# EAGLE design usb_snes (EAGLE 5.11)
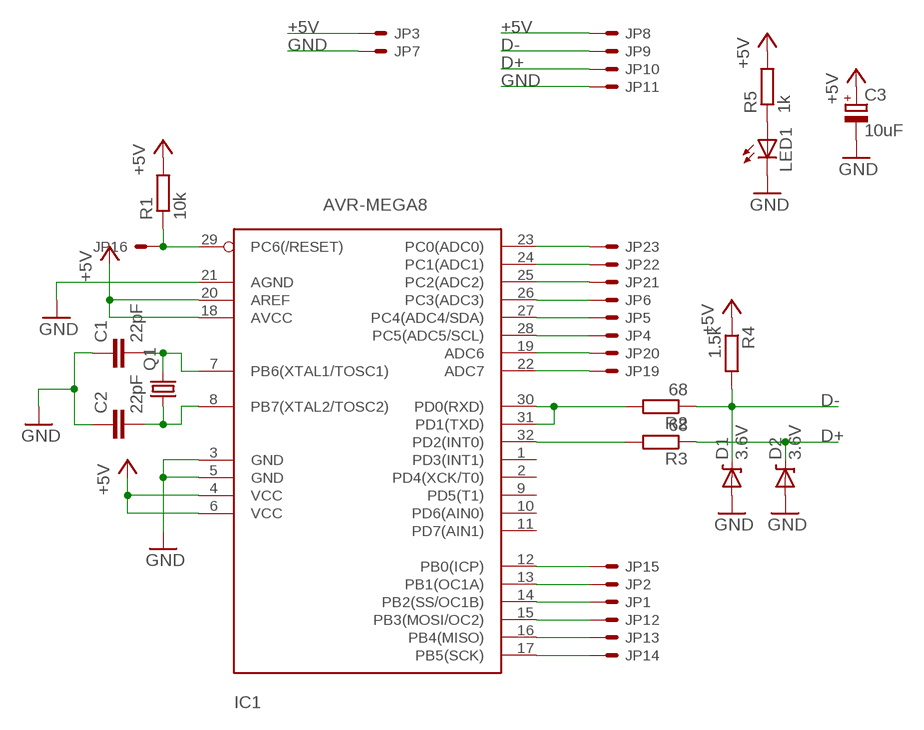
[diagram p0: schematic, sheet 1]

## Parts
C1  22pF  C-EU0805  [0805]
C2  22pF  C-EU0805  [0805]
C3  10uF  CPOL-EUA  [SMC_A]
D1  3.6V  DIODE-ZENERFL  [SOD123FL]
D2  3.6V  DIODE-ZENERFL  [SOD123FL]
IC1  AVR-MEGA8  AVR-MEGA8-AI  [TQFP32-08]
JP1  PIN  [1X01]
JP2  PIN  [1X01]
JP3  PIN  [1X01]
JP4  PIN  [1X01]
JP5  PIN  [1X01]
JP6  PIN  [1X01]
JP7  PIN  [1X01]
JP8  PIN  [1X01]
JP9  PIN  [1X01]
JP10  PIN  [1X01]
JP11  PIN  [1X01]
JP12  PIN  [1X01]
JP13  PIN  [1X01]
JP14  PIN  [1X01]
JP15  PIN  [1X01]
JP16  PIN  [1X01]
JP19  PIN  [1X01]
JP20  PIN  [1X01]
JP21  PIN  [1X01]
JP22  PIN  [1X01]
JP23  PIN  [1X01]
LED1  LED0805  [CHIP-LED0805]
Q1  CRYSTALHC49UP  [HC49UP]
R1  10k  R-EU_0805  [0805]
R2  68  R-EU_0805  [0805]
R3  68  R-EU_0805  [0805]
R4  1.5k  R-EU_0805  [0805]
R5  1k  R-EU_0805  [0805]

## Nets
+5V: C3.+ IC1.4(VCC) IC1.6(VCC) IC1.18(AVCC) IC1.20(AREF) JP3.1(S) JP8.1(S) R1.2 R4.1 R5.2
ADC6: IC1.19(ADC6) JP20.1(S)
ADC7: IC1.22(ADC7) JP19.1(S)
D+: D2.C JP10.1(S) R3.1
D-: D1.C JP9.1(S) R2.1 R4.2
GND: C1.1 C2.1 C3.- D1.A D2.A IC1.3(GND) IC1.5(GND) IC1.21(AGND) JP7.1(S) JP11.1(S) LED1.C
N$1: IC1.29(PC6(/RESET)) JP16.1(S) R1.1
N$2: C2.2 IC1.8(PB7(XTAL2/TOSC2)) Q1.1
N$3: C1.2 IC1.7(PB6(XTAL1/TOSC1)) Q1.2
N$4: IC1.30(PD0(RXD)) IC1.31(PD1(TXD)) R2.2
N$8: IC1.32(PD2(INT0)) R3.2
N$12: LED1.A R5.1
PB0: IC1.12(PB0(ICP)) JP15.1(S)
PB1: IC1.13(PB1(OC1A)) JP2.1(S)
PB2: IC1.14(PB2(SS/OC1B)) JP1.1(S)
PB3: IC1.15(PB3(MOSI/OC2)) JP12.1(S)
PB4: IC1.16(PB4(MISO)) JP13.1(S)
PB5: IC1.17(PB5(SCK)) JP14.1(S)
PC0: IC1.23(PC0(ADC0)) JP23.1(S)
PC1: IC1.24(PC1(ADC1)) JP22.1(S)
PC2: IC1.25(PC2(ADC2)) JP21.1(S)
PC3: IC1.26(PC3(ADC3)) JP6.1(S)
PC4: IC1.27(PC4(ADC4/SDA)) JP5.1(S)
PC5: IC1.28(PC5(ADC5/SCL)) JP4.1(S)
Unconnected: IC1.1(PD3(INT1)) IC1.2(PD4(XCK/T0)) IC1.9(PD5(T1)) IC1.10(PD6(AIN0)) IC1.11(PD7(AIN1))

## Library data of the parts
C1 C2 = snes_usb:C-EU: CAPACITOR, European symbol
C3 = usb_snes:CPOL-EU: POLARIZED CAPACITOR, European symbol
D1 D2 = usb_snes:DIODE-ZENER
IC1 = snes_usb:AVR-MEGA8: MICROCONTROLLER 8 Kbytes FLASH 1 kbytes SRAM 512 bytes EEPROM USART 6-channel 10 bit ADC 2-channel 8 bit ADC
JP1-JP16 JP19-JP23 = usb_snes:PIN
LED1 = usb_snes:LED
Q1 = usb_snes:CRYSTAL: CRYSTAL
R1-R5 = usb_snes:R-EU_: RESISTOR, European symbol

## Board
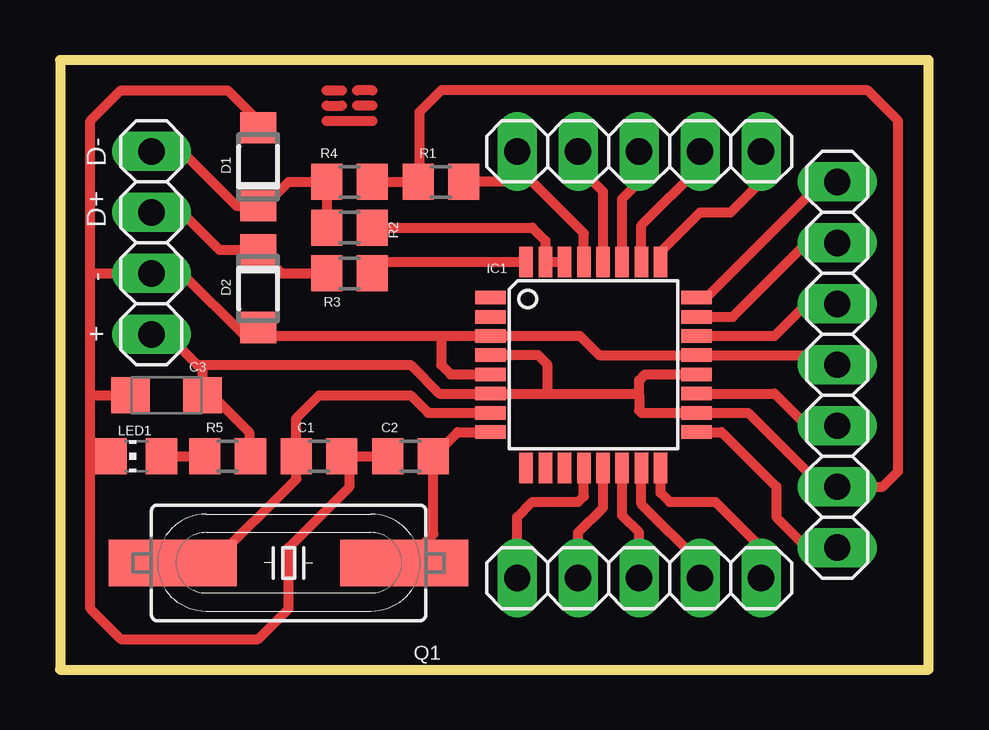
[diagram p1: board, top side]

Size 36.2 x 25.4 mm. Coordinates in mm from the lower left corner, seen from the top.
Outline: 0,0 36.2,0 36.2,25.4 0,25.4 0,0
Copper layers (1*16): Top 0.035mm / dielectric 1.5mm / Bottom 0.035mm
Design rules "default": minimum track width 10mil, minimum drill 24mil, track to track 8mil, track to pad 8mil, pad to pad 8mil, via to via 8mil, smd to smd 8mil, copper to edge 40mil, drill to drill 8mil, minimum pad ring 10mil, minimum via ring 8mil, stop-mask expansion 4mil, vias tented up to drill 0mil, thermal gap 10mil

### Footprints (pad centres in the part's own frame; a part is rotated, then mirrored left to right if it is on the bottom)
R0805 = smd 1.3 x 1.5: 1 -0.95,0; 2 0.95,0
SMC_A = smd 1.6 x 1.5: + -1.5,0; - 1.5,0
SOD123FL = smd 1.3 x 1.5: A 1.625,0; C -1.625,0
TQFP32-08 = smd 1.27 x 0.559: 1 -4.293,2.8; 2 -4.293,2; 3 -4.293,1.2; 4 -4.293,0.4; 5 -4.293,-0.4; 6 -4.293,-1.2; 7 -4.293,-2; 8 -4.293,-2.8; 17 4.293,-2.8; 18 4.293,-2; 19 4.293,-1.2; 20 4.293,-0.4; 21 4.293,0.4; 22 4.293,1.2; 23 4.293,2; 24 4.293,2.8 | smd 0.559 x 1.27: 9 -2.8,-4.293; 10 -2,-4.293; 11 -1.2,-4.293; 12 -0.4,-4.293; 13 0.4,-4.293; 14 1.2,-4.293; 15 2,-4.293; 16 2.8,-4.293; 25 2.8,4.293; 26 2,4.293; 27 1.2,4.293; 28 0.4,4.293; 29 -0.4,4.293; 30 -1.2,4.293; 31 -2,4.293; 32 -2.8,4.293
1X01 = drill 1.1 long: 1 0,0
CHIP-LED0805 = smd 1.5 x 1.3: A 0,-1.05; C 0,1.05
HC49UP = smd 5.334 x 1.93: 1 -4.826,0; 2 4.826,0

### Placement (x,y rotation side)
C1  22pF  [R0805]  10.79,8.89 180 top
C2  22pF  [R0805]  14.61,8.89 0 top
C3  4.45,11.43 180 top
D1  8.26,20.95 90 top
D2  8.26,15.88 270 top
IC1  22.23,12.7 0 top
JP1  24.13,3.81 0 top
JP2  21.59,3.81 0 top
JP3  32.38,7.62 90 top
JP4  21.59,21.59 180 top
JP5  24.13,21.59 180 top
JP6  26.67,21.59 180 top
JP7  32.38,12.7 90 top
JP8  3.81,13.97 90 top
JP9  3.81,21.59 90 top
JP10  3.81,19.05 90 top
JP11  3.81,16.51 90 top
JP12  26.67,3.81 0 top
JP13  29.21,3.81 180 top
JP14  32.38,5.08 90 top
JP15  19.05,3.81 0 top
JP16  19.05,21.59 0 top
JP19  32.38,15.24 90 top
JP20  32.38,10.16 90 top
JP21  29.21,21.59 0 top
JP22  32.38,20.32 270 top
JP23  32.38,17.78 90 top
LED1  3.17,8.89 90 top
Q1  9.53,4.45 180 top
R1  10k  [R0805]  15.88,20.32 180 top
R2  68  [R0805]  12.06,18.41 0 top
R3  68  [R0805]  12.06,16.51 0 top
R4  1.5k  [R0805]  12.06,20.32 180 top
R5  1k  [R0805]  6.99,8.89 0 top
U$1  [LOGO-SMALL-COPPER]  12.06,23.5 0 top

### Tracks (layer width: path | path; a pad name or v marks a point on that pad's centre or on a via)
+5V
  Top 0.406: 20.32,11.5 IC1.6 15.8,11.5 14.61,12.7 5.71,12.7 | IC1.4 19.92,13.1 20.32,12.7 20.32,11.5 | IC1.20 24.36,12.3 24.13,12.06 24.13,11.43 | R4.1 R1.2 14.97,20.37 14.97,23.23 15.88,24.13 33.66,24.13 34.92,22.86 34.92,8.26 34.29,7.62 JP3.1 31.75,7.62 28.67,10.7 IC1.18 24.23,10.7 24.13,10.79 24.13,11.43 | 20.32,11.5 24.06,11.5 24.13,11.43 | R5.2 7.88,9.89 6.35,11.43 C3.+ 5.95,12.47 5.71,12.7 | 5.71,12.7 4.45,13.97 JP8.1
ADC6
  Top 0.406: IC1.19 29.77,11.5 31.11,10.16 JP20.1
ADC7
  Top 0.406: IC1.22 29.77,13.9 31.11,15.24 JP19.1
D+
  Top 0.406: R3.1 9.24,16.51 D2.C 6.63,17.5 5.08,19.05 JP10.1
D-
  Top 0.406: R2.1 R4.2 9.53,20.32 8.54,19.33 D1.C 7.34,19.33 5.08,21.59 JP9.1
GND
  Top 0.406: 12.06,8.89 C1.1 | IC1.5 16.27,12.3 15.88,12.7 15.88,13.9 | 15.88,13.9 IC1.3 21.66,13.9 22.46,13.1 IC1.21 31.98,13.1 JP7.1 | 12.06,8.89 C2.1 | 12.06,8.89 12.06,7.62 9.53,5.08 9.53,2.54 8.26,1.27 2.54,1.27 1.27,2.54 1.27,8.89 | 1.27,8.89 1.27,11.43 | 1.27,11.43 1.27,16.51 | 1.27,16.51 1.27,22.86 2.54,24.13 6.99,24.13 8.26,22.86 D1.A | 1.27,16.51 JP11.1 5.08,16.51 7.69,13.9 8.26,13.9 | 8.26,13.9 15.88,13.9 | 8.26,13.9 D2.A | 1.27,11.43 C3.- | 1.27,8.89 LED1.C
N$1
  Top 0.406: IC1.29 21.82,18.18 19.68,20.32 19.05,20.32 | 19.05,20.32 R1.1 | 19.05,20.32 JP16.1
N$2
  Top 0.406: 14.87,4.96 Q1.1 15.55,5.65 C2.2 16.57,9.9 IC1.8
N$3
  Top 0.406: IC1.7 15.34,10.7 14.61,11.43 10.79,11.43 9.85,10.48 C1.2 9.85,7.94 6.35,4.45 Q1.2
N$4
  Top 0.406: IC1.30 IC1.31 20.23,17.88 19.68,18.41 R2.2
N$8
  Top 0.406: IC1.32 13.45,16.99 R3.2
N$12
  Top 0.406: LED1.A R5.1
PB0
  Top 0.406: IC1.12 21.82,7.22 21.59,6.99 19.68,6.99 19.05,6.35 JP15.1
PB1
  Top 0.406: IC1.13 22.62,6.75 21.59,5.71 JP2.1
PB2
  Top 0.406: IC1.14 23.43,6.42 24.13,5.71 JP1.1
PB3
  Top 0.406: IC1.15 24.23,6.89 26.67,4.45 JP12.1
PB4
  Top 0.406: IC1.16 25.02,7.36 25.4,6.99 27.3,6.99 29.21,5.08 JP13.1
PB5
  Top 0.406: IC1.17 27.57,9.9 29.84,7.62 29.84,6.35 31.11,5.08 JP14.1
PC0
  Top 0.406: IC1.23 28.04,14.7 31.11,17.78 JP23.1
PC1
  Top 0.406: IC1.24 26.93,15.5 31.75,20.32 JP22.1
PC2
  Top 0.406: IC1.25 25.02,17.41 26.67,19.05 27.94,19.05 29.21,20.32 JP21.1
PC3
  Top 0.406: IC1.26 24.23,18.51 26.67,20.95 JP6.1
PC4
  Top 0.406: IC1.27 23.43,19.61 24.13,20.32 JP5.1
PC5
  Top 0.406: IC1.28 22.62,19.92 21.59,20.95 JP4.1

### Text on the board
tNames: D- | D+ | - | +